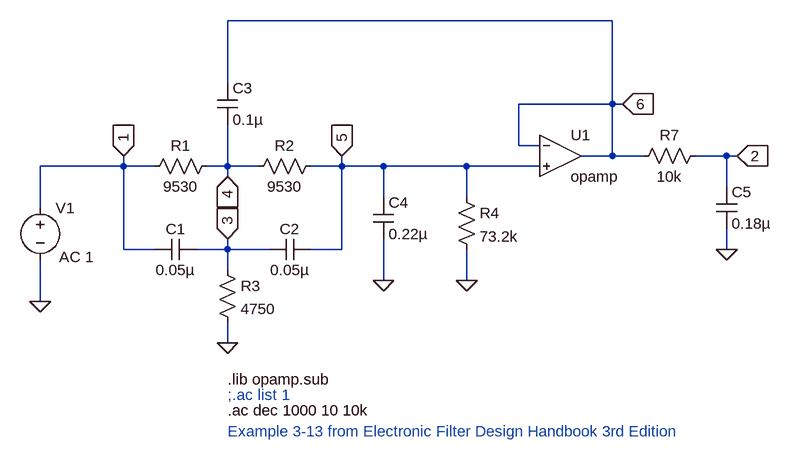
[diagram p0: schematic Elliptic function VCVS LPF.asc]
Elliptic function VCVS LPF.asc, the LTspice schematic file:
Version 4
SHEET 1 1020 680
WIRE 464 -288 -128 -288
WIRE -128 -192 -128 -288
WIRE 464 -160 464 -288
WIRE 464 -160 320 -160
WIRE 480 -160 464 -160
WIRE 320 -96 320 -160
WIRE 352 -96 320 -96
WIRE 464 -80 464 -160
WIRE 464 -80 416 -80
WIRE 512 -80 464 -80
WIRE 640 -80 592 -80
WIRE 656 -80 640 -80
WIRE -288 -64 -288 -80
WIRE -288 -64 -416 -64
WIRE -240 -64 -288 -64
WIRE -128 -64 -128 -128
WIRE -128 -64 -160 -64
WIRE -80 -64 -128 -64
WIRE 48 -64 48 -80
WIRE 48 -64 0 -64
WIRE 112 -64 48 -64
WIRE 240 -64 112 -64
WIRE 352 -64 240 -64
WIRE -128 -48 -128 -64
WIRE 640 -32 640 -80
WIRE 112 -16 112 -64
WIRE 240 -16 240 -64
WIRE -416 0 -416 -64
WIRE -288 64 -288 -64
WIRE -240 64 -288 64
WIRE -128 64 -128 48
WIRE -128 64 -176 64
WIRE -64 64 -128 64
WIRE 48 64 48 -64
WIRE 48 64 0 64
WIRE 640 64 640 32
WIRE -128 96 -128 64
WIRE 112 112 112 48
WIRE 240 112 240 64
WIRE -416 144 -416 80
WIRE -128 208 -128 176
FLAG -128 208 0
FLAG 112 112 0
FLAG 240 112 0
FLAG 640 64 0
FLAG -416 144 0
FLAG -288 -80 1
IOPIN -288 -80 In
FLAG -128 -48 4
IOPIN -128 -48 In
FLAG -128 48 3
IOPIN -128 48 In
FLAG 48 -80 5
IOPIN 48 -80 In
FLAG 656 -80 2
IOPIN 656 -80 In
FLAG 480 -160 6
IOPIN 480 -160 In
SYMBOL res -144 80 R0
SYMATTR InstName R3
SYMATTR Value 4750
SYMBOL res 224 -32 R0
SYMATTR InstName R4
SYMATTR Value 73.2k
SYMBOL res -144 -80 R90
WINDOW 0 0 56 VBottom 2
WINDOW 3 32 56 VTop 2
SYMATTR InstName R1
SYMATTR Value 9530
SYMBOL res 16 -80 R90
WINDOW 0 0 56 VBottom 2
WINDOW 3 32 56 VTop 2
SYMATTR InstName R2
SYMATTR Value 9530
SYMBOL res 608 -96 R90
WINDOW 0 0 56 VBottom 2
WINDOW 3 32 56 VTop 2
SYMATTR InstName R7
SYMATTR Value 10k
SYMBOL cap -176 48 R90
WINDOW 0 0 32 VBottom 2
WINDOW 3 32 32 VTop 2
SYMATTR InstName C1
SYMATTR Value 0.05µ
SYMBOL cap 0 48 R90
WINDOW 0 0 32 VBottom 2
WINDOW 3 32 32 VTop 2
SYMATTR InstName C2
SYMATTR Value 0.05µ
SYMBOL cap -144 -192 R0
SYMATTR InstName C3
SYMATTR Value 0.1µ
SYMBOL cap 96 -16 R0
SYMATTR InstName C4
SYMATTR Value 0.22µ
SYMBOL cap 624 -32 R0
SYMATTR InstName C5
SYMATTR Value 0.18µ
SYMBOL OpAmps\\opamp 384 -144 R0
SYMATTR InstName U1
SYMBOL voltage -416 -16 R0
WINDOW 123 29 92 Left 2
WINDOW 39 0 0 Left 0
SYMATTR Value2 AC 1
SYMATTR InstName V1
SYMATTR Value ""
TEXT -128 288 Left 2 ;;.ac list 1
TEXT -128 264 Left 2 !.lib opamp.sub
TEXT -128 312 Left 2 !.ac dec 1000 10 10k
TEXT -128 344 Left 2 ;Example 3-13 from Electronic Filter Design Handbook 3rd Edition

The netlist it stands for:
* Elliptic function VCVS LPF.asc
R3 3 0 4750
R4 5 0 73.2k
R1 4 1 9530
R2 5 4 9530
R7 2 6 10k
C1 3 1 0.05µ
C2 5 3 0.05µ
C3 6 4 0.1µ
C4 5 0 0.22µ
C5 2 0 0.18µ
XU1 6 5 6 opamp Aol=100K GBW=10Meg  ; pins invin noninvin out
V1 1 0 AC 1
* ;.ac list 1
.lib opamp.sub
.ac dec 1000 10 10k
* Example 3-13 from Electronic Filter Design Handbook 3rd Edition
.backanno
.end